# Altium schematic sheet CON_EEM.SchDoc: EEM connector & drivers
size 420 x 297 mm; Author: G.Kasprowicz; CompanyName: WUT ISE; DrawnBy: G.Kasprowicz; Organization: WUT ISE; Address1: PW ISE; Address2: Nowowiejska 15/19 00-665 Warsaw; Address3: gkasprow@gmail.com; DocumentNumber: 19; Revision: 1.0; SheetNumber: 19; SheetTotal: 37; ModifiedBy: -; CheckedDate: -; DivGrp: WUT ISE; Designer: G.Kasprowicz; Title2: Title 2; ModifiedDate: -; ProjectName: Sensor Box
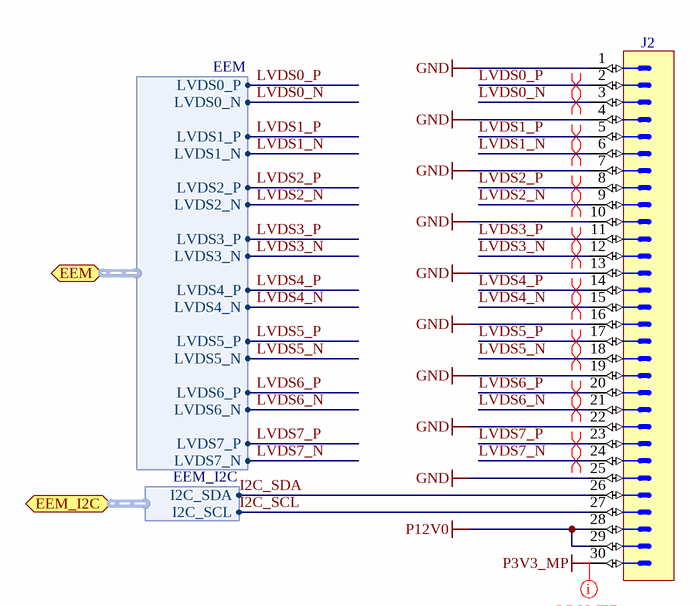
[diagram p0: CON_EEM.SchDoc]

## Parts
J2  (no value)  [3M_N2530-6002RB]

## Ports
EEM (bidir, harness EEM), EEM_I2C (bidir, harness EEM_I2C)

## Harnesses
EEM: LVDS0_P, LVDS0_N, LVDS1_P, LVDS1_N, LVDS2_P, LVDS2_N, LVDS3_P, LVDS3_N, LVDS4_P, LVDS4_N, LVDS5_P, LVDS5_N, LVDS6_P, LVDS6_N, LVDS7_P, LVDS7_N
EEM_I2C: I2C_SDA, I2C_SCL

## Nets
GND: J2.1 J2.4 J2.7 J2.10 J2.13 J2.16 J2.19 J2.22 J2.25
P3V3_MP: J2.30
P12V0: J2.28 J2.29
I2C_SCL: J2.27 ; port EEM_I2C.I2C_SCL
I2C_SDA: J2.26 ; port EEM_I2C.I2C_SDA
LVDS0_N: J2.3 ; port EEM.LVDS0_N
LVDS0_P: J2.2 ; port EEM.LVDS0_P
LVDS1_N: J2.6 ; port EEM.LVDS1_N
LVDS1_P: J2.5 ; port EEM.LVDS1_P
LVDS2_N: J2.9 ; port EEM.LVDS2_N
LVDS2_P: J2.8 ; port EEM.LVDS2_P
LVDS3_N: J2.12 ; port EEM.LVDS3_N
LVDS3_P: J2.11 ; port EEM.LVDS3_P
LVDS4_N: J2.15 ; port EEM.LVDS4_N
LVDS4_P: J2.14 ; port EEM.LVDS4_P
LVDS5_N: J2.18 ; port EEM.LVDS5_N
LVDS5_P: J2.17 ; port EEM.LVDS5_P
LVDS6_N: J2.21 ; port EEM.LVDS6_N
LVDS6_P: J2.20 ; port EEM.LVDS6_P
LVDS7_N: J2.24 ; port EEM.LVDS7_N
LVDS7_P: J2.23 ; port EEM.LVDS7_P

## Layout directives
differential pair: LVDS0_N, LVDS0_P, LVDS1_N, LVDS1_P, LVDS2_N, LVDS2_P, LVDS3_N, LVDS3_P, LVDS4_N, LVDS4_P, LVDS5_N, LVDS5_P, LVDS6_N, LVDS6_P, LVDS7_N, LVDS7_P
net class Lpower: P3V3_MP

## Notes on the sheet
- Project/Equipment
- Document
- Designer
- Drawn by
- Check.by
- Copyright WUT ISE 2020.
  This documentation describes Open Hardware and is licensed under the CERN OHL v.1.2. You may redistribute and modify this documentation under the terms of the CERN OHL v.1.2. (http://ohwr.org/CERNOHL). This documentation is distributed WITHOUT ANY EXPRESS OR IMPLIED WARRANTY, INCLUDING OF MERCHANTABILITY, SATISFACTORY QUALITY AND FITNESS FOR A PARTICULAR PURPOSE. Please see the CERN OHL v.1.2 for applicable conditions.
- Contact
- File
- Last Mod.
- Print Date
- Sheet
- Size
- A3
- of
- Rev

## Library data of the parts
J2 = 3M_N2530-6002RB: Connector 30 Male; Part Description: 30 Contacts - Straight .100'' x .100'' Low Profile Four-Wall Header, 2500 Series; Manufacturer: 3M; PressFit: No; Part Number: 3M_N2530-6002RB; Component Kind: Standard; Component Type: Standard; Pin Count: 30; Family: Header 30; Mounted: Yes; Socket: No; SMD: No; Sense: No; Status: None; Manufacturer Part Number: N2530-6002RB; ComponentHeight: 10.03mm; HelpURL: \\cern.ch\dfs\Applications\Altium\Datasheets\3M_N2530-6002RB.pdf; Author: CERN DEM JLC; CreateDate: 11.02.2009; LatestRevisionDate: 11.08.2009